# Altium schematic sheet Beacon_V2.SchDoc
size A3; SheetNumber: 1; SheetTotal: 1
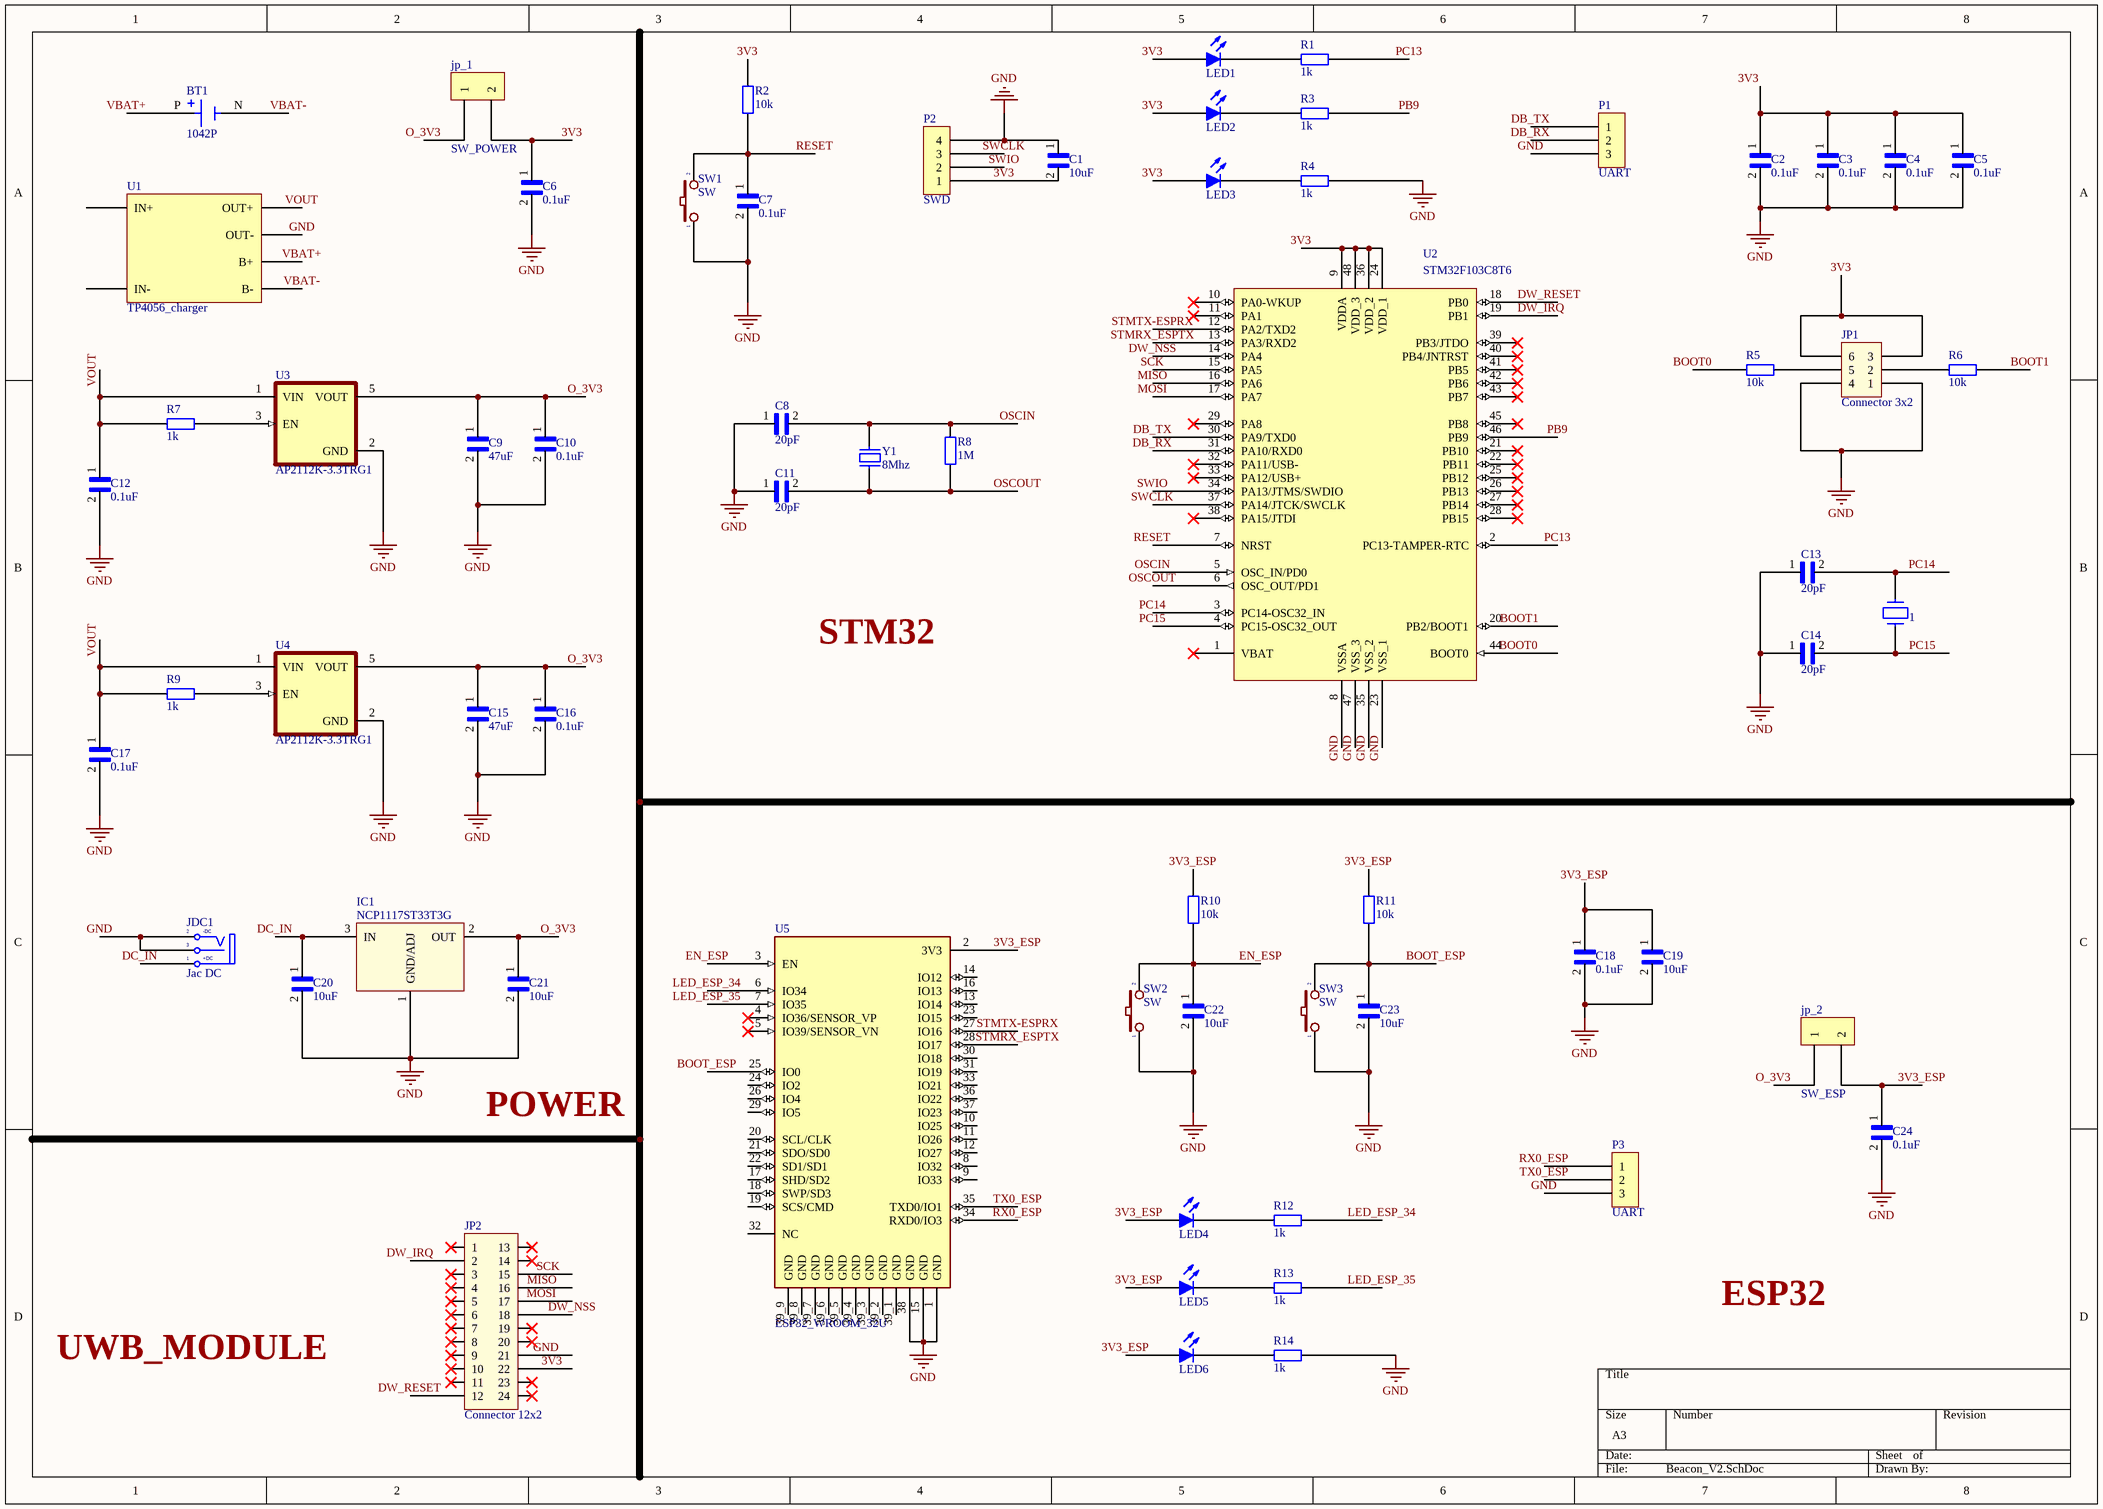
[diagram p0: Beacon_V2.SchDoc]

## Parts
1  ABS07  [ABS07]  (value not drawn)
BT1  1042P  [BAT_1042P]
C1  10uF  [Capacitor_0805]
C2  0.1uF  [Capacitor_0805]
C3  0.1uF  [Capacitor_0805]
C4  0.1uF  [Capacitor_0805]
C5  0.1uF  [Capacitor_0805]
C6  0.1uF  [Capacitor_0805]
C7  0.1uF  [Capacitor_0805]
C8  20pF  [Capacitor_0805]
C9  47uF  [Capacitor_0805]
C10  0.1uF  [Capacitor_0805]
C11  20pF  [Capacitor_0805]
C12  0.1uF  [Capacitor_0805]
C13  20pF  [Capacitor_0805]
C14  20pF  [Capacitor_0805]
C15  47uF  [Capacitor_0805]
C16  0.1uF  [Capacitor_0805]
C17  0.1uF  [Capacitor_0805]
C18  0.1uF  [Capacitor_0805]
C19  10uF  [Capacitor_0805]
C20  10uF  [Capacitor_0805]
C21  10uF  [Capacitor_0805]
C22  10uF  [Capacitor_0805]
C23  10uF  [Capacitor_0805]
C24  0.1uF  [Capacitor_0805]
IC1  NCP1117ST33T3G  [SOT223-3_ONS]
JDC1  Jac DC  [DC-IN]
JP1  Connector 3x2  [JP3x2]
JP2  Connector 12x2  [JP12X2_1]
jp_1  SW_POWER  [JP_1x2]
jp_2  SW_ESP  [JP_1x2]
LED1  Led  [Led 0805 Blue]  (value not drawn)
LED2  Led  [Led 0805 Blue]  (value not drawn)
LED3  Led  [Led 0805 Blue]  (value not drawn)
LED4  Led  [Led 0805 Blue]  (value not drawn)
LED5  Led  [Led 0805 Blue]  (value not drawn)
LED6  Led  [Led 0805 Blue]  (value not drawn)
P1  UART  [HDR/Header/3/BOX]
P2  SWD  [HDR/Header/4/BOX]
P3  UART  [HDR/Header/3/BOX]
R1  1k  [tro smd 0805]
R2  10k  [tro smd 0805]
R3  1k  [tro smd 0805]
R4  1k  [tro smd 0805]
R5  10k  [tro smd 0805]
R6  10k  [tro smd 0805]
R7  1k  [tro smd 0805]
R8  1M  [tro smd 0805]
R9  1k  [tro smd 0805]
R10  10k  [tro smd 0805]
R11  10k  [tro smd 0805]
R12  1k  [tro smd 0805]
R13  1k  [tro smd 0805]
R14  1k  [tro smd 0805]
SW1  SW  [SW1-SMD]
SW2  SW  [SW1-SMD]
SW3  SW  [SW1-SMD]
U1  TP4056_charger  [TP4056_charger]
U2  STM32F103C8T6  [LQFP48]
U3  AP2112K-3.3TRG1  [SOT95P285X140-5N]
U4  AP2112K-3.3TRG1  [SOT95P285X140-5N]
U5  ESP32_WROOM_32U  [ESP32_WROOM_32U]
Y1  8Mhz  [Thach Anh 2 chan SMD5032]

## Nets
GND: C1.1 C2.2 C3.2 C4.2 C5.2 C6.2 C7.2 C8.1 C9.2 C10.2 C11.1 C12.2 C13.1 C14.1 C15.2 C16.2 C17.2 C18.2 C19.2 C20.2 C21.2 C22.2 C23.2 C24.2 IC1.1(GND/ADJ) JDC1.2(TN) JDC1.3(S) JP1.1 JP1.4 JP2.21 P1.3 P2.4 P3.3 R4.2 R14.2 SW1.1 SW2.1 SW3.1 U1.4(OUT-) U2.8(VSSA) U2.23(VSS_1) U2.35(VSS_2) U2.47(VSS_3) U3.2(GND) U4.2(GND) U5.1(GND) U5.15(GND) U5.38(GND)
3V3: C1.2 C2.1 C3.1 C4.1 C5.1 C6.1 JP1.3 JP1.6 JP2.22 jp_1.2 LED1.1(A) LED2.1(A) LED3.1(A) P2.1 R2.2 U2.9(VDDA) U2.24(VDD_1) U2.36(VDD_2) U2.48(VDD_3)
3V3_ESP: C18.1 C19.1 C24.1 jp_2.2 LED4.1(A) LED5.1(A) LED6.1(A) R10.2 R11.2 U5.2(3V3)
BOOT0: R5.1 U2.44(BOOT0)
BOOT1: R6.2 U2.20(PB2/BOOT1)
BOOT_ESP: C23.1 R11.1 SW3.2 U5.25(IO0)
DB_RX: P1.2 U2.31(PA10/RXD0)
DB_TX: P1.1 U2.30(PA9/TXD0)
DC_IN: C20.1 IC1.3(IN) JDC1.1(T)
DW_IRQ: JP2.2 U2.19(PB1)
DW_NSS: JP2.18 U2.14(PA4)
DW_RESET: JP2.12 U2.18(PB0)
EN_ESP: C22.1 R10.1 SW2.2 U5.3(EN)
LED_ESP_34: R12.2 U5.6(IO34)
LED_ESP_35: R13.2 U5.7(IO35)
MISO: JP2.16 U2.16(PA6)
MOSI: JP2.17 U2.17(PA7)
O_3V3: C9.1 C10.1 C15.1 C16.1 C21.1 IC1.2(OUT) jp_1.1 jp_2.1 U3.5(VOUT) U4.5(VOUT)
OSCIN: C8.2 R8.2 U2.5(OSC_IN/PD0) Y1.2
OSCOUT: C11.2 R8.1 U2.6(OSC_OUT/PD1) Y1.1
PB9: R3.2 U2.46(PB9)
PC13: R1.2 U2.2(PC13-TAMPER-RTC)
PC14: 1.2 C13.2 U2.3(PC14-OSC32_IN)
PC15: 1.1 C14.2 U2.4(PC15-OSC32_OUT)
RESET: C7.1 R2.1 SW1.2 U2.7(NRST)
RX0_ESP: P3.1 U5.34(RXD0/IO3)
SCK: JP2.15 U2.15(PA5)
STMRX_ESPTX: U2.13(PA3/RXD2) U5.28(IO17)
STMTX-ESPRX: U2.12(PA2/TXD2) U5.27(IO16)
SWCLK: P2.3 U2.37(PA14/JTCK/SWCLK)
SWIO: P2.2 U2.34(PA13/JTMS/SWDIO)
TX0_ESP: P3.2 U5.35(TXD0/IO1)
VBAT+: BT1.P(POS) U1.1(B+)
VBAT-: BT1.N(NEG) U1.2(B-)
VOUT: C12.1 C17.1 R7.1 R9.1 U1.3(OUT+) U3.1(VIN) U4.1(VIN)
NetJP1_2: JP1.2 R6.1
NetJP1_5: JP1.5 R5.2
NetLED1_2: LED1.2(K) R1.1
NetLED2_2: LED2.2(K) R3.1
NetLED3_2: LED3.2(K) R4.1
NetLED4_2: LED4.2(K) R12.1
NetLED5_2: LED5.2(K) R13.1
NetLED6_2: LED6.2(K) R14.1
NetR7_2: R7.2 U3.3(EN)
NetR9_2: R9.2 U4.3(EN)

Not connected (* = marked no-connect by the designer): JP2 1* 3* 4* 5* 6* 7* 8* 9* 10* 11* 13* 14* 19* 20* 23* 24*; U1 5(IN+) 6(IN-); U2 1(VBAT)* 10(PA0-WKUP)* 11(PA1)* 21(PB10)* 22(PB11)* 25(PB12)* 26(PB13)* 27(PB14)* 28(PB15)* 29(PA8)* 32(PA11/USB-)* 33(PA12/USB+)* 38(PA15/JTDI)* 39(PB3/JTDO)* 40(PB4/JNTRST)* 41(PB5)* 42(PB6)* 43(PB7)* 45(PB8)*; U5 4(IO36/SENSOR_VP)* 5(IO39/SENSOR_VN)* 8(IO32) 9(IO33) 10(IO25) 11(IO26) 12(IO27) 13(IO14) 14(IO12) 16(IO13) 17(SHD/SD2) 18(SWP/SD3) 19(SCS/CMD) 20(SCL/CLK) 21(SDO/SD0) 22(SD1/SD1) 23(IO15) 24(IO2) 26(IO4) 29(IO5) 30(IO18) 31(IO19) 32(NC) 33(IO21) 36(IO22) 37(IO23) 39_1(GND) 39_2(GND) 39_3(GND) 39_4(GND) 39_5(GND) 39_6(GND) 39_7(GND) 39_8(GND) 39_9(GND)

## Notes on the sheet
- STM32
- POWER
- ESP32
- UWB_MODULE
- (in symbol DCIN) -DC; +DC

## Library data of the parts
1 = ABS07: SMD Quartz Crystal; Created By: Zion Blue; Published: 28 April 2014; Publisher: Cynetik Group
BT1 = 1042P: SMT Polarized Battery Holder for 18650 Battery | Keystone Electronics 1042P; SnapEDA_Link: https://www.snapeda.com/parts/1042P/Keystone/view-part/?ref=snap; Package: None; Value: *; MF: Keystone Electronics; MP: 1042P; Check_prices: https://www.snapeda.com/parts/1042P/Keystone/view-part/?ref=eda
C1-C24 = Capacitor_0805: Capacitor; Ceramic; Cap; .220uF; Tol 10%; SMT; Vol-Rtg 50V; X7R; Tape And Reel
IC1 = NCP1117ST33T3G: SOT223
JDC1 = DCIN: Jac DC input; Value: Jac DC
JP1 = JP3x2: Value: Connector 3x2
JP2 = JP12x2: Value: Connector 12x2
jp_1 jp_2 = JP_1x2
LED1-LED6 = Led: Typical LED
P1 P3 = Header 3: Header, 3-Pin
P2 = Header 4_1: Header, 4-Pin
R1 R3 R4 R7 R9 R12-R14 = Tro 0805 1% 1k: Dán; Don_Vi: Con; So_Chan: 2; Ten_Linh_Kien: Trở 0805 1% 1k; Ma_Hang: MH005468; Chung_Loai: Dán; Kieu_Chan: *
R2 R5 R6 R10 R11 = Tro 0805 1% 10k: Dán; Don_Vi: Con; So_Chan: 2; Ten_Linh_Kien: Trở 0805 1% 10k; Ma_Hang: MH005473; Chung_Loai: Dán; Kieu_Chan: *
R8 = Tro 0805 1% 1M: Dán; Don_Vi: Con; So_Chan: 2; Ten_Linh_Kien: Trở 0805 1% 1M; Ma_Hang: MH005469; Chung_Loai: Dán; Kieu_Chan: *
SW1-SW3 = SW2: Switch button 2 pin; Value: SW chip 2 pin
U2 = STM32F103C8T6: STM32 ARM-based 32-bit MCU with ARM 32-bit Cortex-M3 Microcontroller, 128 Kbytes Flash, 48-pin LQFP, Industrial Temperature; Published: 30-May-2008; DatasheetVersion: rev6, Mar-2008; PackageVersion: Mar-2008; PackageReference: LQFP48; Publisher: Altium Limited; PackageDescription: 48-Pin Low-Profile Quad Flat Pack, 7 x 7 mm Body, 0.5 mm Pitch (LQFP48); ComponentLink1Description: Manufacturer Link; ComponentLink1URL: www.st.com/stm32; ComponentLink2Description: Datasheet; ComponentLink2URL: http://www.st.com/stonline/products/literature/ds/13586.pdf
U3 U4 = AP2112K-3.3TRG1: Linear Voltage Regulator IC Positive Fixed 1 Output 600mA SOT-25; MF: Diodes Inc.; Value: *; Purchase-URL: https://pricing.snapeda.com/search/part/AP2112K-3.3TRG1/?ref=eda; Package: SOT-753 Diodes Inc.; Availability: In Stock; Check_prices: https://www.snapeda.com/parts/AP2112K-3.3TRG1/Diodes+Inc./view-part/?ref=eda; Price: None; SnapEDA_Link: https://www.snapeda.com/parts/AP2112K-3.3TRG1/Diodes+Inc./view-part/?ref=snap; MP: AP2112K-3.3TRG1
U5 = ESP32_WROOM_32U: Bluetooth, WiFi 802.11b/g/n, Bluetooth v4.2 +EDR, Class 1, 2 and 3 Transceiver Module 2.4GHz ~ 2.5GHz Antenna Not Included, U.FL Surface Mount
Y1 = Thach Anh 2 chan SMD 5032: Crystal For all Crystal 2pin.; Value: 4Mhz